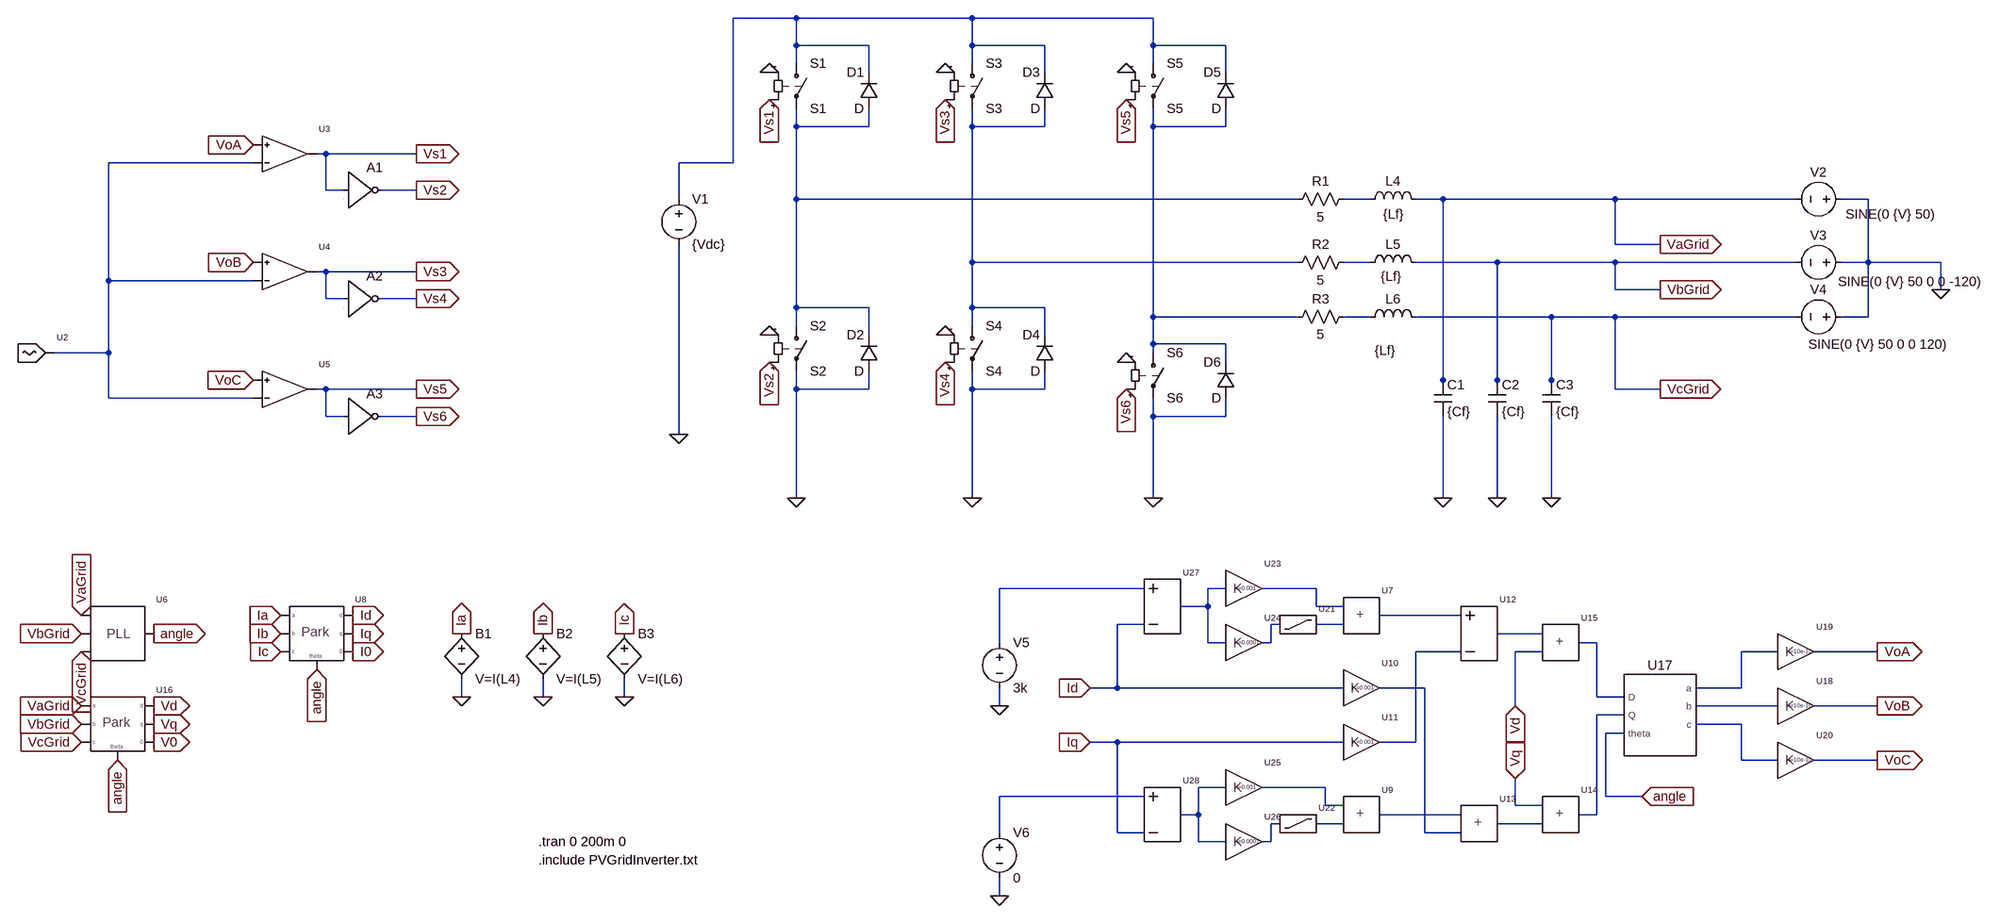
[diagram p0: schematic PVGridInverter.asc]
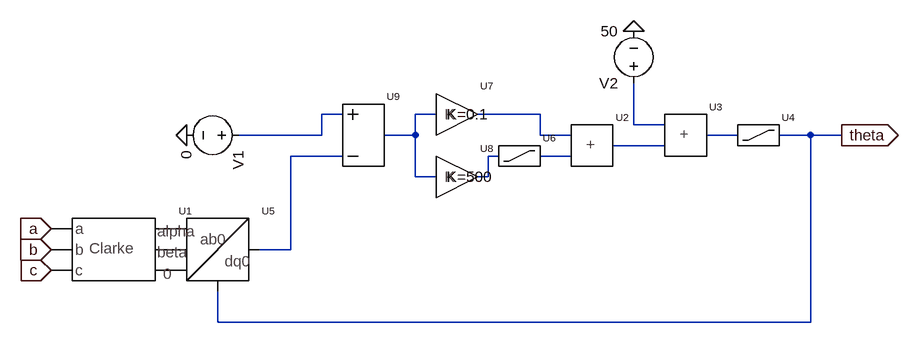
[diagram p1: sub-circuit pll.asc]
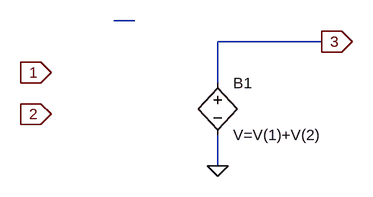
[diagram p2: sub-circuit adder.asc]
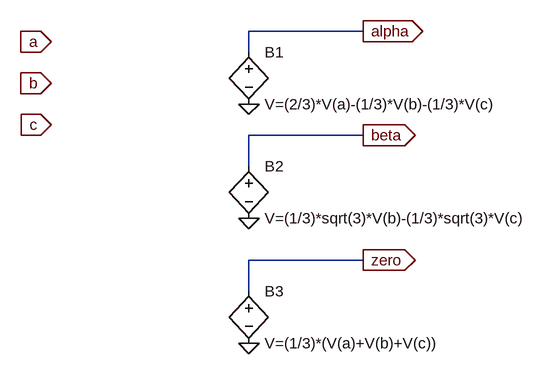
[diagram p3: sub-circuit clarke.asc]
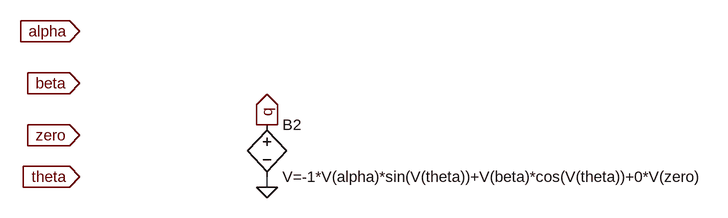
[diagram p4: sub-circuit alphabeta-dq.asc]
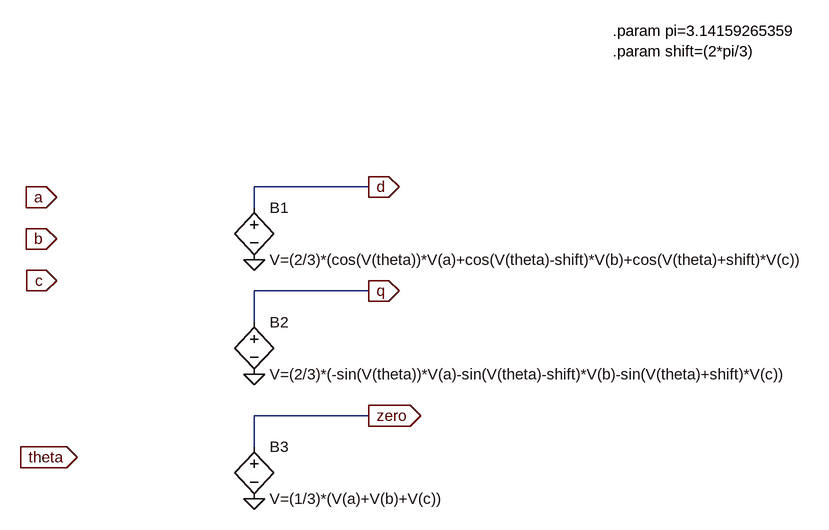
[diagram p5: sub-circuit park.asc]
PVGridInverter.asc, the LTspice schematic file:
Version 4
SHEET 1 2636 1284
WIRE 272 -320 160 -320
WIRE 608 -320 272 -320
WIRE 928 -320 608 -320
WIRE 272 -272 272 -320
WIRE 400 -272 272 -272
WIRE 608 -272 608 -320
WIRE 736 -272 608 -272
WIRE 928 -272 928 -320
WIRE 1056 -272 928 -272
WIRE 272 -240 272 -272
WIRE 608 -240 608 -272
WIRE 928 -240 928 -272
WIRE 400 -224 400 -272
WIRE 736 -224 736 -272
WIRE 1056 -224 1056 -272
WIRE 272 -128 272 -160
WIRE 400 -128 400 -160
WIRE 400 -128 272 -128
WIRE 608 -128 608 -160
WIRE 736 -128 736 -160
WIRE 736 -128 608 -128
WIRE 928 -128 928 -160
WIRE 1056 -128 1056 -160
WIRE 1056 -128 928 -128
WIRE -560 -80 -576 -80
WIRE -400 -80 -560 -80
WIRE -688 -64 -944 -64
WIRE 160 -64 160 -320
WIRE 160 -64 64 -64
WIRE -560 -16 -560 -80
WIRE -528 -16 -560 -16
WIRE -400 -16 -464 -16
WIRE 64 0 64 -64
WIRE 272 0 272 -128
WIRE 1184 0 272 0
WIRE 1312 0 1264 0
WIRE 1440 0 1392 0
WIRE 1744 0 1440 0
WIRE 2064 0 1744 0
WIRE 2192 0 2144 0
WIRE 1744 80 1744 0
WIRE 1824 80 1744 80
WIRE 608 112 608 -128
WIRE 1184 112 608 112
WIRE 1312 112 1264 112
WIRE 1536 112 1392 112
WIRE 1744 112 1536 112
WIRE 2064 112 1744 112
WIRE 2192 112 2192 0
WIRE 2192 112 2144 112
WIRE 2320 112 2192 112
WIRE -560 128 -576 128
WIRE -400 128 -560 128
WIRE -944 144 -944 -64
WIRE -688 144 -944 144
WIRE 1744 160 1744 112
WIRE 1824 160 1744 160
WIRE 2320 160 2320 112
WIRE -560 176 -560 128
WIRE -528 176 -560 176
WIRE -400 176 -464 176
WIRE 272 192 272 0
WIRE 400 192 272 192
WIRE 608 192 608 112
WIRE 736 192 608 192
WIRE 928 208 928 -128
WIRE 1184 208 928 208
WIRE 1312 208 1264 208
WIRE 1632 208 1392 208
WIRE 1744 208 1632 208
WIRE 2064 208 1744 208
WIRE 2192 208 2192 112
WIRE 2192 208 2144 208
WIRE 272 224 272 192
WIRE 608 224 608 192
WIRE 400 240 400 192
WIRE 736 240 736 192
WIRE 928 256 928 208
WIRE 1056 256 928 256
WIRE -944 272 -944 144
WIRE -944 272 -1040 272
WIRE 928 272 928 256
WIRE 1056 288 1056 256
WIRE 1440 320 1440 0
WIRE 1536 320 1536 112
WIRE 1632 320 1632 208
WIRE -560 336 -576 336
WIRE -400 336 -560 336
WIRE 272 336 272 304
WIRE 400 336 400 304
WIRE 400 336 272 336
WIRE 608 336 608 304
WIRE 736 336 736 304
WIRE 736 336 608 336
WIRE 1440 336 1440 320
WIRE 1536 336 1536 320
WIRE 1632 336 1632 320
WIRE 1744 336 1744 208
WIRE 1824 336 1744 336
WIRE -944 352 -944 272
WIRE -688 352 -944 352
WIRE -560 384 -560 336
WIRE -528 384 -560 384
WIRE -400 384 -464 384
WIRE 928 384 928 352
WIRE 1056 384 1056 352
WIRE 1056 384 928 384
WIRE 64 416 64 80
WIRE 272 528 272 336
WIRE 608 528 608 336
WIRE 928 528 928 384
WIRE 1440 528 1440 384
WIRE 1536 528 1536 384
WIRE 1632 528 1632 384
WIRE 912 688 656 688
WIRE 1056 688 1024 688
WIRE 1216 688 1120 688
WIRE 1024 720 1024 688
WIRE 1024 720 976 720
WIRE 1216 720 1216 688
WIRE 1264 720 1216 720
WIRE 1472 736 1328 736
WIRE 912 752 864 752
WIRE 1152 752 1136 752
WIRE 1264 752 1216 752
WIRE 1616 768 1536 768
WIRE 656 784 656 688
WIRE 1024 784 1024 720
WIRE 1056 784 1024 784
WIRE 1136 784 1136 752
WIRE 1136 784 1120 784
WIRE 1712 784 1680 784
WIRE 1472 800 1392 800
WIRE 1616 800 1568 800
WIRE 2032 800 1968 800
WIRE 2208 800 2096 800
WIRE 864 864 864 752
WIRE 864 864 816 864
WIRE 1264 864 864 864
WIRE 1408 864 1328 864
WIRE 1968 864 1968 800
WIRE 1968 864 1888 864
WIRE -320 880 -320 848
WIRE -176 880 -176 848
WIRE -32 880 -32 848
WIRE 1712 880 1712 784
WIRE 1760 880 1712 880
WIRE 656 896 656 864
WIRE 1568 896 1568 800
WIRE 2032 896 1888 896
WIRE 2208 896 2096 896
WIRE 1760 912 1712 912
WIRE 1968 928 1888 928
WIRE 1760 944 1728 944
WIRE 864 960 816 960
WIRE 1264 960 864 960
WIRE 1392 960 1392 800
WIRE 1392 960 1328 960
WIRE 1968 992 1968 928
WIRE 2032 992 1968 992
WIRE 2208 992 2096 992
WIRE 1056 1040 1008 1040
WIRE 1232 1040 1120 1040
WIRE 912 1056 656 1056
WIRE 1728 1056 1728 944
WIRE 1792 1056 1728 1056
WIRE 1232 1072 1232 1040
WIRE 1264 1072 1232 1072
WIRE 1568 1072 1568 1024
WIRE 1616 1072 1568 1072
WIRE 1008 1088 1008 1040
WIRE 1008 1088 976 1088
WIRE 1472 1088 1328 1088
WIRE 1712 1088 1712 912
WIRE 1712 1088 1680 1088
WIRE 1152 1104 1136 1104
WIRE 1264 1104 1216 1104
WIRE 1616 1104 1536 1104
WIRE 656 1120 656 1056
WIRE 864 1120 864 960
WIRE 912 1120 864 1120
WIRE 1408 1120 1408 864
WIRE 1472 1120 1408 1120
WIRE 1008 1136 1008 1088
WIRE 1056 1136 1008 1136
WIRE 1136 1136 1136 1104
WIRE 1136 1136 1120 1136
WIRE 656 1232 656 1200
FLAG 224 -224 0
FLAG 224 240 0
FLAG 560 -224 0
FLAG 880 -224 0
FLAG 880 288 0
FLAG 560 240 0
FLAG -688 -96 VoA
IOPIN -688 -96 In
FLAG -688 112 VoB
IOPIN -688 112 In
FLAG -688 320 VoC
IOPIN -688 320 In
FLAG -400 -80 Vs1
IOPIN -400 -80 Out
FLAG -400 128 Vs3
IOPIN -400 128 Out
FLAG -400 336 Vs5
IOPIN -400 336 Out
FLAG -400 -16 Vs2
IOPIN -400 -16 Out
FLAG -400 176 Vs4
IOPIN -400 176 Out
FLAG -400 384 Vs6
IOPIN -400 384 Out
FLAG 224 -176 Vs1
IOPIN 224 -176 In
FLAG 560 -176 Vs3
IOPIN 560 -176 In
FLAG 560 288 Vs4
IOPIN 560 288 In
FLAG 880 -176 Vs5
IOPIN 880 -176 In
FLAG 880 336 Vs6
IOPIN 880 336 In
FLAG 224 288 Vs2
IOPIN 224 288 In
FLAG 64 416 0
FLAG 2320 160 0
FLAG -864 768 angle
IOPIN -864 768 Out
FLAG -640 736 Ia
IOPIN -640 736 In
FLAG -640 768 Ib
IOPIN -640 768 In
FLAG -640 800 Ic
IOPIN -640 800 In
FLAG -992 736 VaGrid
IOPIN -992 736 In
FLAG -992 768 VbGrid
IOPIN -992 768 In
FLAG -992 800 VcGrid
IOPIN -992 800 In
FLAG -576 832 angle
IOPIN -576 832 In
FLAG -512 736 Id
IOPIN -512 736 Out
FLAG -512 768 Iq
IOPIN -512 768 Out
FLAG -512 800 I0
IOPIN -512 800 Out
FLAG 1536 528 0
FLAG -320 880 0
FLAG -320 768 Ia
IOPIN -320 768 Out
FLAG -176 880 0
FLAG -176 768 Ib
IOPIN -176 768 Out
FLAG -32 880 0
FLAG -32 768 Ic
IOPIN -32 768 Out
FLAG 1824 80 VaGrid
IOPIN 1824 80 Out
FLAG 1824 160 VbGrid
IOPIN 1824 160 Out
FLAG 1824 336 VcGrid
IOPIN 1824 336 Out
FLAG 656 896 0
FLAG 656 1232 0
FLAG -992 896 VaGrid
IOPIN -992 896 In
FLAG -992 928 VbGrid
IOPIN -992 928 In
FLAG -992 960 VcGrid
IOPIN -992 960 In
FLAG -928 992 angle
IOPIN -928 992 In
FLAG -864 896 Vd
IOPIN -864 896 Out
FLAG -864 928 Vq
IOPIN -864 928 Out
FLAG -864 960 V0
IOPIN -864 960 Out
FLAG 1568 1024 Vq
IOPIN 1568 1024 In
FLAG 1568 896 Vd
IOPIN 1568 896 In
FLAG 1792 1056 angle
IOPIN 1792 1056 In
FLAG 2208 800 VoA
IOPIN 2208 800 Out
FLAG 2208 896 VoB
IOPIN 2208 896 Out
FLAG 2208 992 VoC
IOPIN 2208 992 Out
FLAG 816 864 Id
IOPIN 816 864 In
FLAG 816 960 Iq
IOPIN 816 960 In
FLAG 1440 528 0
FLAG 1632 528 0
FLAG 928 528 0
FLAG 608 528 0
FLAG 272 528 0
SYMBOL voltage 64 -16 R0
WINDOW 123 0 0 Left 0
WINDOW 39 0 0 Left 0
SYMATTR InstName V1
SYMATTR Value {Vdc}
SYMBOL sw 272 -256 R0
SYMATTR InstName S1
SYMATTR Value S1
SYMBOL sw 272 208 R0
SYMATTR InstName S2
SYMATTR Value S2
SYMBOL sw 608 -256 R0
SYMATTR InstName S3
SYMATTR Value S3
SYMBOL sw 608 208 R0
SYMATTR InstName S4
SYMATTR Value S4
SYMBOL sw 928 -256 R0
SYMATTR InstName S5
SYMATTR Value S5
SYMBOL sw 928 256 R0
SYMATTR InstName S6
SYMATTR Value S6
SYMBOL diode 416 -160 R180
WINDOW 0 24 64 Left 2
WINDOW 3 24 0 Left 2
SYMATTR InstName D1
SYMBOL diode 416 304 R180
WINDOW 0 24 64 Left 2
WINDOW 3 24 0 Left 2
SYMATTR InstName D2
SYMBOL diode 752 -160 R180
WINDOW 0 24 64 Left 2
WINDOW 3 24 0 Left 2
SYMATTR InstName D3
SYMBOL diode 752 304 R180
WINDOW 0 24 64 Left 2
WINDOW 3 24 0 Left 2
SYMATTR InstName D4
SYMBOL diode 1072 -160 R180
WINDOW 0 24 64 Left 2
WINDOW 3 24 0 Left 2
SYMATTR InstName D5
SYMBOL diode 1072 352 R180
WINDOW 0 24 64 Left 2
WINDOW 3 24 0 Left 2
SYMATTR InstName D6
SYMBOL carriertriangle -1088 272 R0
SYMATTR Value Vc={Vcarrier}
SYMATTR Value2 Tc={T}
SYMATTR InstName U2
SYMBOL compare -640 -80 R0
SYMATTR InstName U3
SYMATTR Value Von=1
SYMBOL compare -640 128 R0
SYMATTR InstName U4
SYMATTR Value Von=1
SYMBOL compare -640 336 R0
SYMATTR InstName U5
SYMATTR Value Von=1
SYMBOL Digital\\inv -528 -80 R0
SYMATTR InstName A1
SYMBOL Digital\\inv -528 112 R0
SYMATTR InstName A2
SYMBOL Digital\\inv -528 320 R0
SYMATTR InstName A3
SYMBOL voltage 2160 0 R90
WINDOW 0 -32 56 VBottom 2
WINDOW 3 11 -71 VTop 2
WINDOW 123 0 0 Left 0
WINDOW 39 0 0 Left 0
SYMATTR InstName V2
SYMATTR Value SINE(0 {V} 50)
SYMBOL voltage 2160 112 R90
WINDOW 0 -32 56 VBottom 2
WINDOW 3 18 -106 VTop 2
WINDOW 123 0 0 Left 0
WINDOW 39 0 0 Left 0
SYMATTR InstName V3
SYMATTR Value SINE(0 {V} 50 0 0 -120)
SYMBOL voltage 2160 208 R90
WINDOW 0 -32 56 VBottom 2
WINDOW 3 33 -49 VTop 2
WINDOW 123 0 0 Left 0
WINDOW 39 0 0 Left 0
SYMATTR InstName V4
SYMATTR Value SINE(0 {V} 50 0 0 120)
SYMBOL PLL -928 768 R0
SYMATTR InstName U6
SYMBOL park -576 768 R0
SYMATTR InstName U8
SYMBOL ind 1296 16 R270
WINDOW 0 32 56 VTop 2
WINDOW 3 5 57 VBottom 2
SYMATTR InstName L4
SYMATTR Value {Lf}
SYMBOL ind 1296 128 R270
WINDOW 0 32 56 VTop 2
WINDOW 3 7 53 VBottom 2
SYMATTR InstName L5
SYMATTR Value {Lf}
SYMBOL ind 1296 224 R270
WINDOW 0 32 56 VTop 2
WINDOW 3 -28 42 VBottom 2
SYMATTR InstName L6
SYMATTR Value {Lf}
SYMBOL cap 1424 320 R0
SYMATTR InstName C1
SYMATTR Value {Cf}
SYMBOL cap 1520 320 R0
SYMATTR InstName C2
SYMATTR Value {Cf}
SYMBOL cap 1616 320 R0
SYMATTR InstName C3
SYMATTR Value {Cf}
SYMBOL res 1280 -16 R90
WINDOW 0 0 56 VBottom 2
WINDOW 3 32 56 VTop 2
SYMATTR InstName R1
SYMATTR Value 5
SYMBOL res 1280 96 R90
WINDOW 0 0 56 VBottom 2
WINDOW 3 32 56 VTop 2
SYMATTR InstName R2
SYMATTR Value 5
SYMBOL res 1280 192 R90
WINDOW 0 0 56 VBottom 2
WINDOW 3 32 56 VTop 2
SYMATTR InstName R3
SYMATTR Value 5
SYMBOL bv -320 752 R0
SYMATTR InstName B1
SYMATTR Value V=I(L4)
SYMBOL bv -176 752 R0
SYMATTR InstName B2
SYMATTR Value V=I(L5)
SYMBOL bv -32 752 R0
SYMATTR InstName B3
SYMATTR Value V=I(L6)
SYMBOL voltage 656 768 R0
WINDOW 123 0 0 Left 0
WINDOW 39 0 0 Left 0
SYMATTR InstName V5
SYMATTR Value 3k
SYMBOL voltage 656 1104 R0
WINDOW 123 0 0 Left 0
WINDOW 39 0 0 Left 0
SYMATTR InstName V6
SYMATTR Value 0
SYMBOL gain 1280 864 R0
WINDOW 3 0 0 Left 0
SYMATTR Value K=0.001
SYMATTR InstName U10
SYMBOL gain 1280 960 R0
WINDOW 3 0 0 Left 0
SYMATTR Value K=0.001
SYMATTR InstName U11
SYMBOL subtractor 1488 736 R0
SYMATTR InstName U12
SYMBOL adder 1504 1104 R0
SYMATTR InstName U13
SYMBOL adder 1648 1088 R0
SYMATTR InstName U14
SYMBOL adder 1648 784 R0
SYMATTR InstName U15
SYMBOL park -928 928 R0
SYMATTR InstName U16
SYMBOL gain 2048 896 R0
WINDOW 3 0 0 Left 0
SYMATTR Value K=10e-10
SYMATTR InstName U18
SYMBOL gain 2048 800 R0
WINDOW 3 0 0 Left 0
SYMATTR Value K=10e-10
SYMATTR InstName U19
SYMBOL gain 2048 992 R0
WINDOW 3 0 0 Left 0
SYMATTR Value K=10e-10
SYMATTR InstName U20
SYMBOL adder 1296 736 R0
SYMATTR InstName U7
SYMBOL adder 1296 1088 R0
SYMATTR InstName U9
SYMBOL integral 1184 752 R0
SYMATTR InstName U21
SYMBOL integral 1184 1104 R0
SYMATTR InstName U22
SYMBOL gain 1072 688 R0
WINDOW 3 0 0 Left 0
SYMATTR Value K=0.001
SYMATTR InstName U23
SYMBOL gain 1072 784 R0
WINDOW 3 0 0 Left 0
SYMATTR Value K=0.0001
SYMATTR InstName U24
SYMBOL gain 1072 1040 R0
WINDOW 3 0 0 Left 0
SYMATTR Value K=0.001
SYMATTR InstName U25
SYMBOL gain 1072 1136 R0
WINDOW 3 0 0 Left 0
SYMATTR Value K=0.0001
SYMATTR InstName U26
SYMBOL subtractor 928 688 R0
SYMATTR InstName U27
SYMBOL subtractor 928 1056 R0
SYMATTR InstName U28
SYMBOL dqtoabc 1824 912 R0
SYMATTR InstName U17
TEXT -184 1136 Left 2 !.tran 0 200m 0
TEXT -184 1168 Left 2 !.include PVGridInverter.txt

pll.asc, the sub-circuit schematic file:
Version 4
SHEET 1 1272 680
WIRE 384 -32 352 -32
WIRE 528 -32 496 -32
WIRE 688 -32 592 -32
WIRE 832 -16 832 -80
WIRE 880 -16 832 -16
WIRE 352 0 352 -32
WIRE 352 0 224 0
WIRE 496 0 496 -32
WIRE 496 0 448 0
WIRE 688 0 688 -32
WIRE 736 0 688 0
WIRE 992 0 944 0
WIRE 1104 0 1056 0
WIRE 1152 0 1104 0
WIRE 880 16 800 16
WIRE 384 32 304 32
WIRE 624 32 608 32
WIRE 736 32 688 32
WIRE 496 64 496 0
WIRE 528 64 496 64
WIRE 608 64 608 32
WIRE 608 64 592 64
WIRE 304 176 304 32
WIRE 304 176 256 176
WIRE 192 288 192 240
WIRE 1104 288 1104 0
WIRE 1104 288 192 288
FLAG 144 0 0
FLAG 832 -160 0
FLAG 1152 0 theta
IOPIN 1152 0 Out
FLAG -64 176 b
IOPIN -64 176 In
FLAG -64 144 a
IOPIN -64 144 In
FLAG -64 208 c
IOPIN -64 208 In
SYMBOL voltage 240 0 R90
WINDOW 123 0 0 Left 0
WINDOW 39 0 0 Left 0
SYMATTR InstName V1
SYMATTR Value 0
SYMBOL adder 912 0 R0
SYMATTR InstName U3
SYMBOL voltage 832 -64 R180
WINDOW 123 0 0 Left 0
WINDOW 39 0 0 Left 0
SYMATTR InstName V2
SYMATTR Value 50
SYMBOL integral 1024 0 R0
SYMATTR InstName U4
SYMBOL clarke 32 176 R0
SYMATTR InstName U1
SYMBOL alphabeta-dq 192 176 R0
SYMATTR InstName U5
SYMBOL adder 768 16 R0
SYMATTR InstName U2
SYMBOL integral 656 32 R0
SYMATTR InstName U6
SYMBOL gain 544 -32 R0
WINDOW 3 0 0 Left 0
SYMATTR Value K=0.1
SYMATTR InstName U7
SYMBOL gain 544 64 R0
WINDOW 3 0 0 Left 0
SYMATTR Value K=500
SYMATTR InstName U8
SYMBOL subtractor 400 -32 R0
SYMATTR InstName U9

adder.asc, the sub-circuit schematic file:
Version 4
SHEET 1 880 680
WIRE 80 48 48 48
WIRE 368 80 208 80
WIRE 208 144 208 80
WIRE 208 272 208 224
FLAG -48 128 1
IOPIN -48 128 In
FLAG -48 192 2
IOPIN -48 192 In
FLAG 208 272 0
FLAG 368 80 3
IOPIN 368 80 Out
SYMBOL bv 208 128 R0
SYMATTR InstName B1
SYMATTR Value V=V(1)+V(2)

clarke.asc, the sub-circuit schematic file:
Version 4
SHEET 1 880 680
WIRE 512 112 336 112
WIRE 336 144 336 112
WIRE 512 272 336 272
WIRE 336 320 336 272
WIRE 512 464 336 464
WIRE 336 512 336 464
FLAG 32 128 a
IOPIN 32 128 In
FLAG 32 192 b
IOPIN 32 192 In
FLAG 32 256 c
IOPIN 32 256 In
FLAG 336 224 0
FLAG 336 400 0
FLAG 512 112 alpha
IOPIN 512 112 Out
FLAG 512 272 beta
IOPIN 512 272 Out
FLAG 336 592 0
FLAG 512 464 zero
IOPIN 512 464 Out
SYMBOL bv 336 128 R0
SYMATTR InstName B1
SYMATTR Value V=(2/3)*V(a)-(1/3)*V(b)-(1/3)*V(c)
SYMBOL bv 336 304 R0
SYMATTR InstName B2
SYMATTR Value V=(1/3)*sqrt(3)*V(b)-(1/3)*sqrt(3)*V(c)
SYMBOL bv 336 496 R0
SYMATTR InstName B3
SYMATTR Value V=(1/3)*(V(a)+V(b)+V(c))

alphabeta-dq.asc, the sub-circuit schematic file:
Version 4
SHEET 1 1192 680
WIRE 416 368 416 352
FLAG 128 128 alpha
IOPIN 128 128 In
FLAG 128 208 beta
IOPIN 128 208 In
FLAG 128 288 zero
IOPIN 128 288 In
FLAG 128 352 theta
IOPIN 128 352 In
FLAG 416 368 0
FLAG 416 272 q
IOPIN 416 272 Out
SYMBOL bv 416 256 R0
SYMATTR InstName B2
SYMATTR Value V=-1*V(alpha)*sin(V(theta))+V(beta)*cos(V(theta))+0*V(zero)

park.asc, the sub-circuit schematic file:
Version 4
SHEET 1 1212 680
WIRE 400 32 224 32
WIRE 224 64 224 32
WIRE 400 192 224 192
WIRE 224 240 224 192
WIRE 400 384 224 384
WIRE 224 432 224 384
FLAG -80 48 a
IOPIN -80 48 In
FLAG -80 112 b
IOPIN -80 112 In
FLAG -80 176 c
IOPIN -80 176 In
FLAG 224 144 0
FLAG 224 320 0
FLAG 400 32 d
IOPIN 400 32 Out
FLAG 400 192 q
IOPIN 400 192 Out
FLAG 224 512 0
FLAG 400 384 zero
IOPIN 400 384 Out
FLAG -48 448 theta
IOPIN -48 448 In
SYMBOL bv 224 48 R0
SYMATTR InstName B1
SYMATTR Value V=(2/3)*(cos(V(theta))*V(a)+cos(V(theta)-shift)*V(b)+cos(V(theta)+shift)*V(c))
SYMBOL bv 224 224 R0
SYMATTR InstName B2
SYMATTR Value V=(2/3)*(-sin(V(theta))*V(a)-sin(V(theta)-shift)*V(b)-sin(V(theta)+shift)*V(c))
SYMBOL bv 224 416 R0
SYMATTR InstName B3
SYMATTR Value V=(1/3)*(V(a)+V(b)+V(c))
TEXT 776 -208 Left 2 !.param pi=3.14159265359\n.param shift=(2*pi/3)

The netlist it stands for:
* PVGridInverter.asc
V1 N001 0 {Vdc}
S1 N001 N002 Vs1 0 S1
S2 N002 0 Vs2 0 S2
S3 N001 N003 Vs3 0 S3
S4 N003 0 Vs4 0 S4
S5 N001 N004 Vs5 0 S5
S6 N004 0 Vs6 0 S6
D1 N002 N001 D
D2 0 N002 D
D3 N003 N001 D
D4 0 N003 D
D5 N004 N001 D
D6 0 N004 D
XU2 N005 triangle Vc={Vcarrier} Tc={T}  ; pins 1
XU3 VoA N005 Vs1 compare Von=1  ; pins 1 2 3
XU4 VoB N005 Vs3 compare Von=1  ; pins 1 2 3
XU5 VoC N005 Vs5 compare Von=1  ; pins 1 2 3
A1 Vs1 0 0 0 0 Vs2 0 0 BUF
A2 Vs3 0 0 0 0 Vs4 0 0 BUF
A3 Vs5 0 0 0 0 Vs6 0 0 BUF
V2 0 VaGrid SINE(0 {V} 50)
V3 0 VbGrid SINE(0 {V} 50 0 0 -120)
V4 0 VcGrid SINE(0 {V} 50 0 0 120)
XU6 VaGrid VbGrid VcGrid angle pll
XU8 Ia Ib Ic angle Id Iq I0 park
L4 N006 VaGrid {Lf}
L5 N007 VbGrid {Lf}
L6 N008 VcGrid {Lf}
C1 VaGrid 0 {Cf}
C2 VbGrid 0 {Cf}
C3 VcGrid 0 {Cf}
R1 N006 N002 5
R2 N007 N003 5
R3 N008 N004 5
B1 Ia 0 V=I(L4)
B2 Ib 0 V=I(L5)
B3 Ic 0 V=I(L6)
V5 N009 0 3k
V6 N025 0 0
XU10 Id N019 gain K=0.001  ; pins 1 2
XU11 Iq N017 gain K=0.001  ; pins 1 2
XU12 N012 N017 N015 subtract  ; pins 1 2 3
XU13 N026 N019 N029 adder
XU14 Vq N029 N021 adder
XU15 N015 Vd N016 adder
XU16 VaGrid VbGrid VcGrid angle Vd Vq V0 park
XU18 N020 VoB gain K=10e-10  ; pins 1 2
XU19 N018 VoA gain K=10e-10  ; pins 1 2
XU20 N022 VoC gain K=10e-10  ; pins 1 2
XU7 N011 N014 N012 adder
XU9 N024 N028 N026 adder
XU21 N013 N014 integral  ; pins 1 2
XU22 N027 N028 integral  ; pins 1 2
XU23 N010 N011 gain K=0.001  ; pins 1 2
XU24 N010 N013 gain K=0.0001  ; pins 1 2
XU25 N023 N024 gain K=0.001  ; pins 1 2
XU26 N023 N027 gain K=0.0001  ; pins 1 2
XU27 N009 Id N010 subtract  ; pins 1 2 3
XU28 N025 Iq N023 subtract  ; pins 1 2 3
XU17 N016 N021 angle N018 N020 N022 dq_to_abc  ; pins D Q theta a b c

* block symbol definitions
.subckt pll a b c theta
V1 N001 0 0
XU3 N004 N006 N005 adder
V2 N004 0 50
XU4 N005 theta integral  ; pins 1 2
XU1 a b c P001 P002 P003 clarke
XU5 P001 P002 P003 theta N007 alphabeta-dq
XU2 N003 N009 N006 adder
XU6 N008 N009 integral  ; pins 1 2
XU7 N002 N003 gain K=0.1  ; pins 1 2
XU8 N002 N008 gain K=500  ; pins 1 2
XU9 N001 N007 N002 subtract  ; pins 1 2 3
.ends pll

.subckt adder 1 2 3
B1 3 0 V=V(1)+V(2)
.ends adder

.subckt clarke a b c alpha beta zero
B1 alpha 0 V=(2/3)*V(a)-(1/3)*V(b)-(1/3)*V(c)
B2 beta 0 V=(1/3)*sqrt(3)*V(b)-(1/3)*sqrt(3)*V(c)
B3 zero 0 V=(1/3)*(V(a)+V(b)+V(c))
.ends clarke

.subckt alphabeta-dq alpha beta zero theta q
B2 q 0 V=-1*V(alpha)*sin(V(theta))+V(beta)*cos(V(theta))+0*V(zero)
.ends alphabeta-dq

.subckt park a b c theta d q zero
B1 d 0 V=(2/3)*(cos(V(theta))*V(a)+cos(V(theta)-shift)*V(b)+cos(V(theta)+shift)*V(c))
B2 q 0 V=(2/3)*(-sin(V(theta))*V(a)-sin(V(theta)-shift)*V(b)-sin(V(theta)+shift)*V(c))
B3 zero 0 V=(1/3)*(V(a)+V(b)+V(c))
.param pi=3.14159265359
.param shift=(2*pi/3)
.ends park

.model D D
.lib standard.dio
.tran 0 200m 0
.include PVGridInverter.txt
.lib carriertriangle.lib
.lib compare.lib
.lib PLL.lib
.lib adder.lib
.lib integral.lib
.lib clarke.lib
.lib alphabeta-dq.lib
.lib gain.lib
.lib subtractor.lib
.lib park.lib
.lib dqtoabc.lib
.backanno
.end